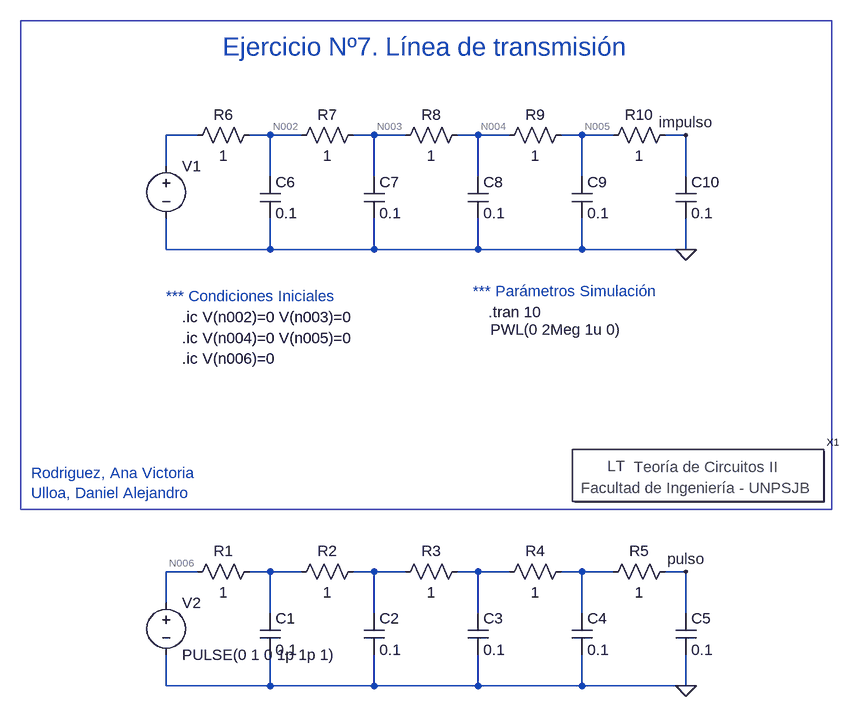
[diagram p0: schematic 09.asc]
09.asc, the LTspice schematic file:
Version 4
SHEET 1 1060 680
WIRE 80 -624 32 -624
WIRE 192 -624 160 -624
WIRE 240 -624 192 -624
WIRE 352 -624 320 -624
WIRE 400 -624 352 -624
WIRE 512 -624 480 -624
WIRE 560 -624 512 -624
WIRE 672 -624 640 -624
WIRE 720 -624 672 -624
WIRE 832 -624 800 -624
WIRE 32 -576 32 -624
WIRE 192 -560 192 -624
WIRE 352 -560 352 -624
WIRE 512 -560 512 -624
WIRE 672 -560 672 -624
WIRE 832 -560 832 -624
WIRE 32 -448 32 -496
WIRE 192 -448 192 -496
WIRE 192 -448 32 -448
WIRE 352 -448 352 -496
WIRE 352 -448 192 -448
WIRE 512 -448 512 -496
WIRE 512 -448 352 -448
WIRE 672 -448 672 -496
WIRE 672 -448 512 -448
WIRE 832 -448 832 -496
WIRE 832 -448 672 -448
WIRE 80 48 32 48
WIRE 192 48 160 48
WIRE 240 48 192 48
WIRE 352 48 320 48
WIRE 400 48 352 48
WIRE 512 48 480 48
WIRE 560 48 512 48
WIRE 672 48 640 48
WIRE 720 48 672 48
WIRE 832 48 800 48
WIRE 32 96 32 48
WIRE 192 112 192 48
WIRE 352 112 352 48
WIRE 512 112 512 48
WIRE 672 112 672 48
WIRE 832 112 832 48
WIRE 32 224 32 176
WIRE 192 224 192 176
WIRE 192 224 32 224
WIRE 352 224 352 176
WIRE 352 224 192 224
WIRE 512 224 512 176
WIRE 512 224 352 224
WIRE 672 224 672 176
WIRE 672 224 512 224
WIRE 832 224 832 176
WIRE 832 224 672 224
FLAG 832 -448 0
FLAG 832 224 0
FLAG 832 -624 impulso
FLAG 832 48 pulso
SYMBOL Circuitos2\\Letreros\\Teoría\ de\ Circuitos\ II 848 -96 R0
SYMATTR InstName X1
SYMBOL voltage 32 80 R0
WINDOW 123 0 0 Left 0
WINDOW 39 0 0 Left 0
SYMATTR InstName V2
SYMATTR Value PULSE(0 1 0 1p 1p 1)
SYMBOL res 176 -640 R90
WINDOW 0 0 56 VBottom 2
WINDOW 3 32 56 VTop 2
SYMATTR InstName R6
SYMATTR Value 1
SYMBOL cap 176 -560 R0
SYMATTR InstName C6
SYMATTR Value 0.1
SYMBOL res 336 -640 R90
WINDOW 0 0 56 VBottom 2
WINDOW 3 32 56 VTop 2
SYMATTR InstName R7
SYMATTR Value 1
SYMBOL cap 336 -560 R0
SYMATTR InstName C7
SYMATTR Value 0.1
SYMBOL res 496 -640 R90
WINDOW 0 0 56 VBottom 2
WINDOW 3 32 56 VTop 2
SYMATTR InstName R8
SYMATTR Value 1
SYMBOL cap 496 -560 R0
SYMATTR InstName C8
SYMATTR Value 0.1
SYMBOL res 656 -640 R90
WINDOW 0 0 56 VBottom 2
WINDOW 3 32 56 VTop 2
SYMATTR InstName R9
SYMATTR Value 1
SYMBOL cap 656 -560 R0
SYMATTR InstName C9
SYMATTR Value 0.1
SYMBOL res 816 -640 R90
WINDOW 0 0 56 VBottom 2
WINDOW 3 32 56 VTop 2
SYMATTR InstName R10
SYMATTR Value 1
SYMBOL cap 816 -560 R0
SYMATTR InstName C10
SYMATTR Value 0.1
SYMBOL voltage 32 -592 R0
WINDOW 3 499 267 Left 2
WINDOW 123 0 0 Left 0
WINDOW 39 0 0 Left 0
SYMATTR InstName V1
SYMATTR Value PWL(0 2Meg 1u 0)
SYMBOL res 176 32 R90
WINDOW 0 0 56 VBottom 2
WINDOW 3 32 56 VTop 2
SYMATTR InstName R1
SYMATTR Value 1
SYMBOL cap 176 112 R0
SYMATTR InstName C1
SYMATTR Value 0.1
SYMBOL res 336 32 R90
WINDOW 0 0 56 VBottom 2
WINDOW 3 32 56 VTop 2
SYMATTR InstName R2
SYMATTR Value 1
SYMBOL cap 336 112 R0
SYMATTR InstName C2
SYMATTR Value 0.1
SYMBOL res 496 32 R90
WINDOW 0 0 56 VBottom 2
WINDOW 3 32 56 VTop 2
SYMATTR InstName R3
SYMATTR Value 1
SYMBOL cap 496 112 R0
SYMATTR InstName C3
SYMATTR Value 0.1
SYMBOL res 656 32 R90
WINDOW 0 0 56 VBottom 2
WINDOW 3 32 56 VTop 2
SYMATTR InstName R4
SYMATTR Value 1
SYMBOL cap 656 112 R0
SYMATTR InstName C4
SYMATTR Value 0.1
SYMBOL res 816 32 R90
WINDOW 0 0 56 VBottom 2
WINDOW 3 32 56 VTop 2
SYMATTR InstName R5
SYMATTR Value 1
SYMBOL cap 816 112 R0
SYMATTR InstName C5
SYMATTR Value 0.1
TEXT 56 -344 Left 2 !.ic V(n002)=0 V(n003)=0
TEXT 432 -760 Center 4 ;Ejercicio Nº7. Línea de transmisión
TEXT -176 -104 Left 2 ;Rodriguez, Ana Victoria\nUlloa, Daniel Alejandro
TEXT 32 -376 Left 2 ;*** Condiciones Iniciales
TEXT 504 -384 Left 2 ;*** Parámetros Simulación
TEXT 56 -312 Left 2 !.ic V(n004)=0 V(n005)=0
TEXT 56 -280 Left 2 !.ic V(n006)=0
TEXT 528 -352 Left 2 !.tran 10
RECTANGLE Normal 1056 -48 -192 -800

The netlist it stands for:
* 09.asc
XX1 Teoría de Circuitos II
V2 N006 0 PULSE(0 1 0 1p 1p 1)
R6 N002 N001 1
C6 N002 0 0.1
R7 N003 N002 1
C7 N003 0 0.1
R8 N004 N003 1
C8 N004 0 0.1
R9 N005 N004 1
C9 N005 0 0.1
R10 impulso N005 1
C10 impulso 0 0.1
V1 N001 0 PWL(0 2Meg 1u 0)
R1 N007 N006 1
C1 N007 0 0.1
R2 N008 N007 1
C2 N008 0 0.1
R3 N009 N008 1
C3 N009 0 0.1
R4 N010 N009 1
C4 N010 0 0.1
R5 pulso N010 1
C5 pulso 0 0.1
.ic V(n002)=0 V(n003)=0
* Ejercicio Nº7. Línea de transmisión
* Rodriguez, Ana Victoria
* Ulloa, Daniel Alejandro
* *** Condiciones Iniciales
* *** Parámetros Simulación
.ic V(n004)=0 V(n005)=0
.ic V(n006)=0
.tran 10
.backanno
.end